# Altium schematic sheet Sheet3.SchDoc
size Letter; Author: C.F.; DrawnBy: Camille Fortin; Organization: Cegep Limoilou; Address1: 1300, 8e Avenue; Address2: Québec, QC; Address3: Canada; Address4: G1J 5L5; Revision: A; SheetNumber: 3; SheetTotal: 3; Conception: Camillle Fortin; Titre: Panneau Projet Adam; Modification: C.F.
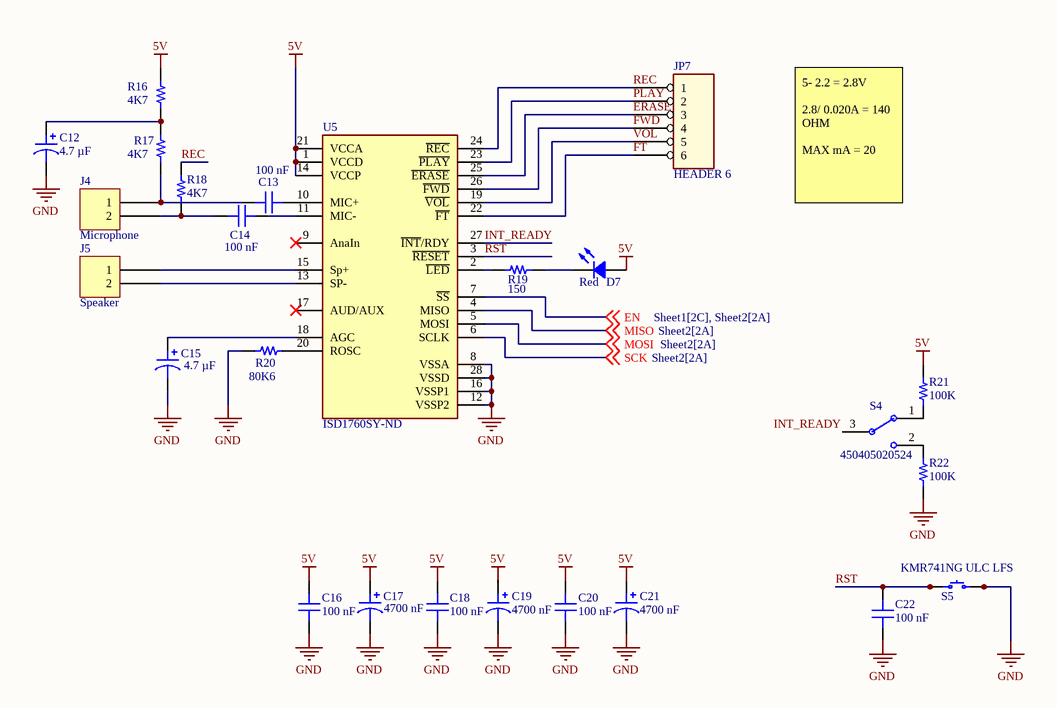
[diagram p0: Sheet3.SchDoc]

## Parts
C12  4.7 µF  [CAP ALUM 4.3MM2]
C13  100 nF  [CAP 0603]
C14  100 nF  [CAP 0603]
C15  4.7 µF  [CAP ALUM 4.3MM2]
C16  100 nF  [CAP 0603]
C17  4700 nF  [CAP ALSMD ELEC 4.3MM H5.4MM]
C18  100 nF  [CAP 0603]
C19  4700 nF  [CAP ALSMD ELEC 4.3MM H5.4MM]
C20  100 nF  [CAP 0603]
C21  4700 nF  [CAP ALUM 4.3MM2]
C22  100 nF  [CAP 0603]
D7  Red  [Blue LED 0603]
J4  Microphone  [CONN FEM HEADER 2PIN]
J5  Speaker  [CONN FEM HEADER 2PIN]
JP7  HEADER 6  [J\6P]
R16  4K7  [RES 0603]
R17  4K7  [RES 0603]
R18  4K7  [RES 0603]
R19  150  [RES 0603]
R20  80K6  [RES 0603]
R21  100K  [RES 0603]
R22  100K  [RES 0603]
S4  450405020524  [SL 3Pos Switch]
S5  KMR741NG ULC LFS  [Switch Lin SMD]
U5  Supplier Part Number 1: ISD1760SY-ND  [ISD1760SY]  (hidden comment: ISD1760SY)

## Nets
5V: C16.2 C17.1 C18.2 C19.1 C20.2 C21.1 D7.1 R16.2 R21.2 U5.1(VCCD) U5.14(VCCP) U5.21(VCCA)
GND: C12.2 C15.2 C16.1 C17.2 C18.1 C19.2 C20.1 C21.2 C22.1 R20.1 R22.1 S5.3 S5.4 U5.8(VSSA) U5.12(VSSP2) U5.16(VSSP1) U5.28(VSSD)
EN: U5.7(~{SS}) ; off-sheet EN
ERASE: JP7.3 U5.25(~{ERASE})
FT: JP7.6 U5.22(~{FT})
FWD: JP7.4 U5.26(~{FWD})
INT_READY: S4.3(COM) U5.27(~{INT}/RDY)
MISO: U5.4(MISO) ; off-sheet MISO
MOSI: U5.5(MOSI) ; off-sheet MOSI
PLAY: JP7.2 U5.23(~{PLAY})
REC: JP7.1 R18.2 U5.24(~{REC})
RST: C22.2 S5.1 S5.2 U5.3(~{RESET})
SCK: U5.6(SCLK) ; off-sheet SCK
VOL: JP7.5 U5.19(~{VOL})
NetC12_1: C12.1 R16.1 R17.2
NetC13_1: C13.1 U5.10(MIC+)
NetC13_2: C13.2 J4.1 R17.1
NetC14_1: C14.1 U5.11(MIC-)
NetC14_2: C14.2 J4.2 R18.1
NetC15_1: C15.1 U5.18(AGC)
NetD7_2: D7.2 R19.2
NetJ5_1: J5.1 U5.15(Sp+)
NetJ5_2: J5.2 U5.13(SP-)
NetR19_1: R19.1 U5.2(~{LED})
NetR20_2: R20.2 U5.20(ROSC)
NetR21_1: R21.1 S4.1
NetR22_2: R22.2 S4.2

Not connected (* = marked no-connect by the designer): U5 9(AnaIn)* 17(AUD/AUX)*

## Notes on the sheet
- 5- 2.2 = 2.8V
  2.8/ 0.020A = 140 OHM
  MAX mA = 20
- Titre :
- Conception :
- Date :
- Modification :
- Heure :
- Révision :
- Feuille
- de
- Fichier :

## Library data of the parts
C12 C15 = EMVE350ADA4R7MD55G: CAP ALUM 4.7UF 20% 35V SMD; manufacturer: United Chemi-Con; Lifetime @ Temp.: 1000 Hrs @ 105°C; Polarization: Polar; Ripple Current @ Low Frequency: 16 mA @ 120 Hz; Surface Mount Land Size: 0.169" L x 0.169" W (4.30mm x 4.30mm); Part Number: EMVE350ADA4R7MD55G; Applications: General Purpose; Capacitance: 4.7 µF; componentlink1description: Datasheet; componentlink1url: //media.digikey.com/pdf/Data%20Sheets/United%20Chemi-Con%20PDFs/MVE%20Series.pdf; componentlink2description: DigiKey Link; componentlink2url: https://www.digikey.com/en/products/detail/united-chemi-con/EMVE350ADA4R7MD55G/756875; Device Package: Radial, Can - SMD; Height - Seated (Max): 0.205" (5.20mm); lastupdated: 2023-04-04 19:53:03; Lifecycle Status: Active; Minimum Order: 1; Mounting Type: Surface Mount; Operating Temperature: -40°C ~ 105°C; Package / Case: Radial, Can - SMD; packaging: TapeAndReel; partid: 7039; Part Status: Active; price: 0.06; series: Alchip™- MVE; Size / Dimension: 0.157" Dia (4.00mm); Supplier 1: DigiKey; Supplier Part Number 1: 565-2229-1-ND; Tolerance: ±20%; value: 4.7 µF; Voltage - Rated: 35 V
C13 C14 C16 C18 C20 C22 = CS0603KRX7R7BB104: CAP CER 0.1UF 16V X7R 0603; manufacturer: Yageo; Capacitance: 0.1 µF; Tolerance: ±10%; Part Number: CS0603KRX7R7BB104; Value: 100 nF; Applications: Boardflex Sensitive; componentlink1description: Datasheet; componentlink1url: http://www.yageo.com/NewPortal/yageodocoutput?fileName=/pdf/MLCC/UPY-ST_NPOX7R_16V-to-3KV_5.pdf; componentlink2description: DigiKey Link; componentlink2url: https://www.digikey.com/en/products/detail/yageo/CS0603KRX7R7BB104/6097897; Device Package: 0603 (1608 Metric); Features: Soft Termination; lastupdated: 2023-04-02 19:09:22; Lifecycle Status: Active; Minimum Order: 1; Mounting Type: Surface Mount, MLCC; Operating Temperature: -55°C ~ 125°C; Package / Case: 0603 (1608 Metric); packaging: TapeAndReel; partid: 2286; Part Status: Active; price: 0.01; series: CS; Size / Dimension: 0.063" L x 0.031" W (1.60mm x 0.80mm); Supplier 1: DigiKey; Supplier Part Number 1: 311-3560-1-ND; Temperature Coefficient: X7R; Thickness (Max): 0.037" (0.95mm); Voltage - Rated: 16V
C17 C19 C21 = EMVE350ADA4R7MD55G: CAP ALUM 4.7UF 20% 35V SMD; manufacturer: United Chemi-Con; Capacitance: 4.7 µF; Lifetime @ Temp.: 1000 Hrs @ 105°C; Polarization: Polar; Ripple Current @ Low Frequency: 16 mA @ 120 Hz; Surface Mount Land Size: 0.169" L x 0.169" W (4.30mm x 4.30mm); value: 4.7 µF; Part Number: EMVE350ADA4R7MD55G; Applications: General Purpose; componentlink1description: Datasheet; componentlink1url: //media.digikey.com/pdf/Data%20Sheets/United%20Chemi-Con%20PDFs/MVE%20Series.pdf; componentlink2description: DigiKey Link; componentlink2url: https://www.digikey.com/en/products/detail/united-chemi-con/EMVE350ADA4R7MD55G/756875; Device Package: Radial, Can - SMD; Height - Seated (Max): 0.205" (5.20mm); lastupdated: 2023-04-04 19:53:03; Lifecycle Status: Active; Minimum Order: 1; Mounting Type: Surface Mount; Operating Temperature: -40°C ~ 105°C; Package / Case: Radial, Can - SMD; packaging: TapeAndReel; partid: 7039; Part Status: Active; price: 0.06; series: Alchip™- MVE; Size / Dimension: 0.157" Dia (4.00mm); Supplier 1: DigiKey; Supplier Part Number 1: 565-2229-1-ND; Tolerance: ±20%; Voltage - Rated: 35 V
D7 = BL-HUB36A-AV-TRB: 0603 RED; Manufacturer: American Bright Optoelectronics Corporation; Configuration: Standard; Current - Test: 20mA; Lens Color: Colorless; Lens Style: Rectangle with Flat Top; Lens Transparency: Clear; Millicandela Rating: 94mcd; Viewing Angle: 120°; Voltage - Forward (Vf) (Typ): 2.2V; Wavelength - Dominant: 632nm; Wavelength - Peak: 645nm; Part Number: BL-HUB36A-AV-TRB; Color: Red; ComponentLink1Description: Datasheet; ComponentLink1URL: https://americanbrightled.com/pdffiles/smt/BL-HUB36A-AV-TRB.pdf; ComponentLink2Description: DigiKey Link; ComponentLink2URL: https://www.digikey.com/en/products/detail/american-bright-optoelectronics-corporation/BL-HUB36A-AV-TRB/9678174; Device Package: 0603 (1608 Metric); Height (Max): 0.70mm; LastUpdated: 2023-03-27 19:53:19; Lifecycle Status: Active; Minimum Order: 1; Mounting Type: Surface Mount; Package / Case: 0603 (1608 Metric); Packaging: TapeAndReel; PartId: 1020; Part Status: Active; Price: 0.04; Series: -; Size / Dimension: 1.60mm L x 0.80mm W; Supplier 1: DigiKey; Supplier Part Number 1: BL-HUB36A-AV-TRBCT-ND; Supplier Device Package: 0603; Value: Red
J4 J5 = 282834-2: TERM BLK 2P SIDE ENT 2.54MM PCB; Manufacturer: TE Connectivity AMP Connectors; Current: 10A; Mating Orientation: Horizontal with Board; Number of Levels: 1; Pitch: 0.100" (2.54mm); Positions Per Level: 2; Voltage: 150V; Wire Gauge: 16-30 AWG; Wire Termination: Screw - Rising Cage Clamp; Part Number: 282834-2; Color: Green; ComponentLink1Description: Datasheet; ComponentLink1URL: https://www.te.com/commerce/DocumentDelivery/DDEController?Action=srchrtrv&DocNm=282834&DocType=Customer+Drawing&DocLang=English; ComponentLink2Description: DigiKey Link; ComponentLink2URL: http://digikey.com/product-detail/en/te-connectivity-amp-connectors/282834-2/A98333-ND/1150135; LastUpdated: 2020-01-15 04:15:38; Lifecycle Status: Active; Minimum Order: 1; Mounting Type: Through Hole; Packaging: Bulk; Part Status: Active; Price: 0.88; Series: Buchanan; Supplier 1: DigiKey; Supplier Part Number 1: A98333-ND
R16-R18 = RMCF0603FT4K70: RES 4.7K OHM 1% 1/10W 0603; Manufacturer: Stackpole Electronics Inc; Power (Watts): 0.1W, 1/10W; Resistance: 4.7 kOhms; Temperature Coefficient: ±100ppm/°C; Part Number: RMCF0603FT4K70; Value: 4K7; ComponentLink1Description: Datasheet; ComponentLink1URL: https://www.seielect.com/catalog/sei-rmcf_rmcp.pdf; ComponentLink2Description: DigiKey Link; ComponentLink2URL: https://www.digikey.com/en/products/detail/stackpole-electronics-inc/RMCF0603FT4K70/1760998; Composition: Thick Film; Device Package: 0603 (1608 Metric); Features: Automotive AEC-Q200; Height - Seated (Max): 0.022" (0.55mm); LastUpdated: 2023-04-04 19:29:43; Lifecycle Status: Active; Minimum Order: 1; Number of Terminations: 2; Operating Temperature: -55°C ~ 155°C; Package / Case: 0603 (1608 Metric); Packaging: CutTape; PartId: 6078; Part Status: Active; Price: 0.01; Ratings: AEC-Q200; Series: RMCF; Size / Dimension: 0.061" L x 0.031" W (1.55mm x 0.80mm); Supplier 1: DigiKey; Supplier Part Number 1: RMCF0603FT4K70CT-ND; Supplier Device Package: 0603; Tolerance: ±1%
R19 = MCT0603MD1500BP100: RES SMD 150 OHM 0.1% 1/8W 0603; Manufacturer: Vishay Beyschlag; Power (Watts): 0.125W, 1/8W; Resistance: 150 Ohms; Temperature Coefficient: ±25ppm/°C; Part Number: MCT0603MD1500BP100; Value: 150; ComponentLink1Description: Datasheet; ComponentLink1URL: http://www.vishay.com/docs/28785/mcat_pre.pdf; ComponentLink2Description: DigiKey Link; ComponentLink2URL: http://digikey.com/product-detail/en/vishay-beyschlag/MCT0603MD1500BP100/MCT0603-150-MBCT-ND/2092134; Composition: Thin Film; Device Package: 0603 (1608 Metric); Features: Anti-Sulfur, Automotive AEC-Q200; Height - Seated (Max): 0.022" (0.55mm); LastUpdated: 2023-04-04 19:29:46; Lifecycle Status: Active; Minimum Order: 1; Number of Terminations: 2; Operating Temperature: -55°C ~ 155°C; Package / Case: 0603 (1608 Metric); Packaging: TapeAndReel; PartId: 5246; Part Status: Active; Price: 0.23; Ratings: AEC-Q200; Series: MCT AT - Precision; Size / Dimension: 0.061" L x 0.033" W (1.55mm x 0.85mm); Supplier 1: DigiKey; Supplier Part Number 1: MCT0603-150-MBCT-ND; Supplier Device Package: 0603; Tolerance: ±0.1%
R20 = RCS060380K6FKEA: RES SMD 80.6K OHM 1% 1/4W 0603; Manufacturer: Vishay Dale; Power (Watts): 0.25W, 1/4W; Resistance: 80.6 kOhms; Temperature Coefficient: ±100ppm/°C; Part Number: RCS060380K6FKEA; Value: 80K6; ComponentLink1Description: Datasheet; ComponentLink1URL: https://www.vishay.com/docs/20065/rcse3.pdf; ComponentLink2Description: DigiKey Link; ComponentLink2URL: https://www.digikey.com/en/products/detail/vishay-dale/RCS060380K6FKEA/5868691; Composition: Thick Film; Device Package: 0603 (1608 Metric); Features: Automotive AEC-Q200, Pulse Withstanding; Height - Seated (Max): 0.020" (0.50mm); LastUpdated: 2023-04-04 19:27:58; Lifecycle Status: Active; Minimum Order: 1; Number of Terminations: 2; Operating Temperature: -55°C ~ 155°C; Package / Case: 0603 (1608 Metric); Packaging: TapeAndReel; PartId: 62631; Part Status: Active; Price: 0.02; Ratings: AEC-Q200; Series: RCS e3; Size / Dimension: 0.061" L x 0.033" W (1.55mm x 0.85mm); Supplier 1: DigiKey; Supplier Part Number 1: 541-RCS060380K6FKEACT-ND; Supplier Device Package: 0603; Tolerance: ±1%
R21 R22 = CMP0603AFX-1003ELF: RESHIGHPOWERA 0603 100K 1% 1/4W; Manufacturer: Bourns Inc.; Power (Watts): 0.25W, 1/4W; Resistance: 100 kOhms; Temperature Coefficient: ±100ppm/°C; Part Number: CMP0603AFX-1003ELF; Value: 100K; ComponentLink1Description: Datasheet; ComponentLink1URL: https://www.bourns.com/docs/Product-Datasheets/CMP-A.pdf; ComponentLink2Description: DigiKey Link; ComponentLink2URL: https://www.digikey.com/en/products/detail/bourns-inc/CMP0603AFX-1003ELF/12333642; Composition: Thick Film; Device Package: 0603 (1608 Metric); Features: Anti-Sulfur, Automotive AEC-Q200, Moisture Resistant, Pulse Withstanding; Height - Seated (Max): 0.022" (0.55mm); LastUpdated: 2023-04-04 19:28:10; Lifecycle Status: Active; Minimum Order: 1; Number of Terminations: 2; Operating Temperature: -55°C ~ 155°C; Package / Case: 0603 (1608 Metric); Packaging: TapeAndReel; PartId: 64150; Part Status: Active; Price: 0.03; Ratings: AEC-Q200; Series: CMP-A; Size / Dimension: 0.063" L x 0.031" W (1.60mm x 0.80mm); Supplier 1: DigiKey; Supplier Part Number 1: 118-CMP0603AFX-1003ELFCT-ND; Supplier Device Package: 0603; Tolerance: ±1%
S4 = 450405020524: SMT 8.7 X 3.0 MM MINI SLIDE SWIT; Manufacturer: Würth Elektronik; Rated Current: 300mA; Rated Voltage: 5VDC; Switching Function: On-On; Circuit: SPDT; Actuator Length: 2.00mm; Actuator Type: Standard; Contact Timing: Non-Shorting (BBM); Current Rating (Amps): 300mA (DC); Voltage Rating - DC: 5 V; ComponentLink1Description: Datasheet; ComponentLink1URL: https://www.we-online.com/catalog/datasheet/450405020524.pdf; ComponentLink2Description: DigiKey Link; ComponentLink2URL: https://www.digikey.com/en/products/detail/würth-elektronik/450405020524/11627297; Packaging: TapeAndReel; Publisher: Wurth Elektronik; Contact Material: Copper Alloy; Mounting Technology: SMT; Operating Temperature: -40°C ~ 85°C; Contact Plating: Silver; Part Number: 450405020524; Published Date: November 2019; Terminal Material: Copper Alloy; Size: 8.7x3mm; Terminal Plating: Silver; Contact Finish: Silver; LastUpdated: 2022-06-20 13:21:27; Lifecycle Status: Active; Minimum Order: 1; Mounting Type: Surface Mount; PartId: 4; Part Status: Active; Price: 0.73; Series: WS-SLSU; Supplier 1: DigiKey; Supplier Part Number 1: 732-450405020524CT-ND; Switch Function: On-On; Termination Style: SMD (SMT) Tab
S5 = KMR741NG ULC LFS: SWITCH TACTILE SPST-NO 50MA 32V; Manufacturer: C&K; Actuator Height off PCB, Vertical: 2.50mm; Actuator Orientation: Top Actuated; Actuator Type: Standard; Contact Rating @ Voltage: 0.05A @ 32VDC; Illumination: Non-Illuminated; Ingress Protection: IP67 - Dust Tight, Waterproof; Operating Force: 400gf; Outline: 4.20mm x 2.80mm; Switch Function: Off-Mom; Part Number: KMR741NG ULC LFS; Circuit: SPST-NO; ComponentLink1Description: Datasheet; ComponentLink1URL: https://dznh3ojzb2azq.cloudfront.net/products/Tactile/KMR7/documents/datasheet.pdf; ComponentLink2Description: DigiKey Link; ComponentLink2URL: http://digikey.com/product-detail/en/c-k/KMR741NG-ULC-LFS/CKN10688CT-ND/6035360; LastUpdated: 2020-04-09 10:01:05; Lifecycle Status: Active; Minimum Order: 1; Mounting Type: Surface Mount; Operating Temperature: -40°C ~ 85°C; Packaging: TapeAndReel; Part Status: Active; Price: 0.16; Series: KMR7; Supplier 1: DigiKey; Supplier Part Number 1: CKN10688CT-ND; Termination Style: Gull Wing
U5 = ISD1760SY: Voice Record/Playback IC Multiple Message 40 ~ 120 Sec Pushbutton, SPI 28-SOIC; Manufacturer Part Number: ISD1760SY; Supplier 1: Digi-Key